# Altium schematic sheet STMOD+.SchDoc: STMOD+ Interface
size A4; Author: P.A.; CompanyName: STMicroelectronics; Organization: Microcontrollers Division; Address1: 12, Rue Jules HOROWITZ; Address2: 38019 Grenoble; Address3: FRANCE; DocumentNumber: MB1261; Revision: B.01; SheetNumber: 14; SheetTotal: 15; Project: STM32L496G-DISCO
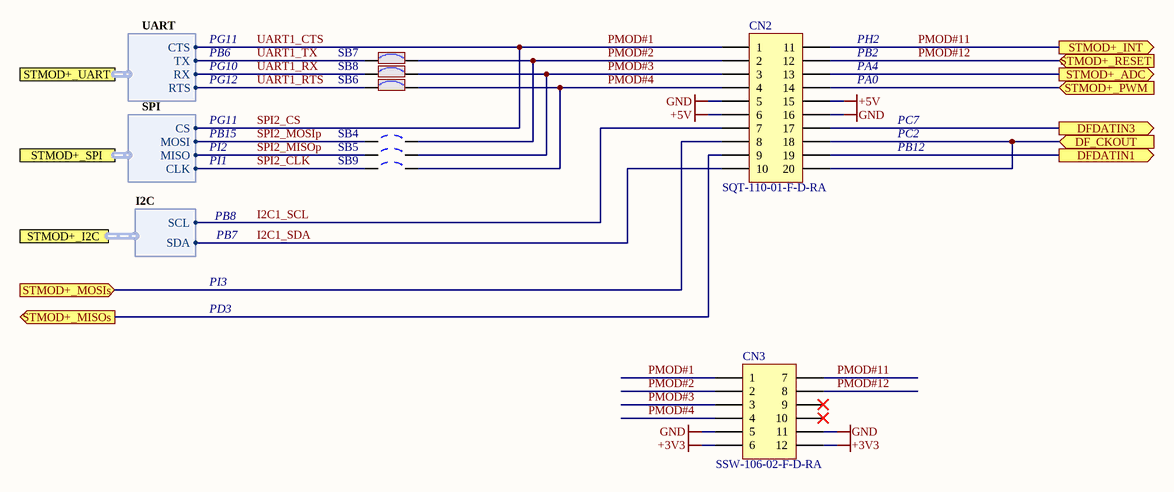
[diagram p0: STMOD+.SchDoc]

## Parts
CN2  SQT-110-01-F-D-RA  [SQT-110-01-F-D-RA]
CN3  SSW-106-02-F-D-RA  [SSW-106-02-F-D-RA]
SB4  Solder Bridge OFF  [SB_0603]  (value not drawn)
SB5  Solder Bridge OFF  [SB_0603]  (value not drawn)
SB6  Solder Bridge ON  [SB_0603]  (value not drawn)
SB7  Solder Bridge ON  [SB_0603]  (value not drawn)
SB8  Solder Bridge ON  [SB_0603]  (value not drawn)
SB9  Solder Bridge OFF  [SB_0603]  (value not drawn)

## Ports
DF_CKOUT (in), DFDATIN1 (out), DFDATIN3 (out), STMOD+_ADC (out), STMOD+_I2C (harness I2C), STMOD+_INT (out), STMOD+_MISOs (out), STMOD+_MOSIs (in), STMOD+_PWM (in), STMOD+_RESET (in), STMOD+_SPI (harness SPI), STMOD+_UART (harness UART)

## Harnesses
UART: RX, TX, RTS, CTS
SPI: MISO, MOSI, CLK, CS
I2C: SDA, SCL

## Nets
+3V3: CN3.6 CN3.12
+5V: CN2.6 CN2.15
GND: CN2.5 CN2.16 CN3.5 CN3.11
DF_CKOUT: CN2.18 CN2.20 ; port DF_CKOUT
DFDATIN1: CN2.19 ; port DFDATIN1
DFDATIN3: CN2.17 ; port DFDATIN3
I2C1_SCL: CN2.7 ; port STMOD+_I2C.SCL
I2C1_SDA: CN2.10 ; port STMOD+_I2C.SDA
PMOD#1: CN2.1 CN3.1 ; port STMOD+_UART.CTS, port STMOD+_SPI.CS  [also labelled SPI2_CS, UART1_CTS]
PMOD#2: CN2.2 CN3.2 SB4.2 SB7.2
PMOD#3: CN2.3 CN3.3 SB5.2 SB8.2
PMOD#4: CN2.4 CN3.4 SB6.2 SB9.2
PMOD#11: CN2.11 CN3.7 ; port STMOD+_INT
PMOD#12: CN2.12 CN3.8 ; port STMOD+_RESET
SPI2_CLK: SB9.1 ; port STMOD+_SPI.CLK
SPI2_MISOp: SB5.1 ; port STMOD+_SPI.MISO
SPI2_MOSIp: SB4.1 ; port STMOD+_SPI.MOSI
STMOD+_ADC: CN2.13 ; port STMOD+_ADC
STMOD+_MISOs: CN2.9 ; port STMOD+_MISOs
STMOD+_MOSIs: CN2.8 ; port STMOD+_MOSIs
STMOD+_PWM: CN2.14 ; port STMOD+_PWM
UART1_RTS: SB6.1 ; port STMOD+_UART.RTS
UART1_RX: SB8.1 ; port STMOD+_UART.RX
UART1_TX: SB7.1 ; port STMOD+_UART.TX

Not connected (* = marked no-connect by the designer): CN3 9* 10*

## Notes on the sheet
- PG11
- PH2
- PG10
- PG12
- PB6
- PA0
- PA4
- PB2
- PB15
- PI1
- PI2
- PB12
- PC2
- PC7
- PB8
- PB7
- PD3
- PI3
- Title:
- Project:
- Size:
- Revision:
- Variant:
- A4
- -
- Date:
- Reference:
- Sheet:
- of

## Library data of the parts
CN2 = Header 10X2A: Header, 10-Pin, Dual row; Manuf_1: ATOM; Manuf_Part_1: FH200210C-12000; Ordered by: Subcon
CN3 = Header 6X2A: Header, 6-Pin, Dual row; Manuf_Part_1: FH254206C-1600; Manuf_1: ATOM; Ordered by: Subcon
SB4 SB5 SB9 = SB_OFF: Solder: NO; Revision: July-2002: Re-released for DXP Platform.; ECCN_US/EU: N/A
SB6-SB8 = SB_ON: Manuf_1: YAGEO; Manuf_Part_1: RC0603JR-070RL; Solder: YES; Ordered By: Subcon; Revision: July-2002: Re-released for DXP Platform.; ECCN_US/EU: N/A